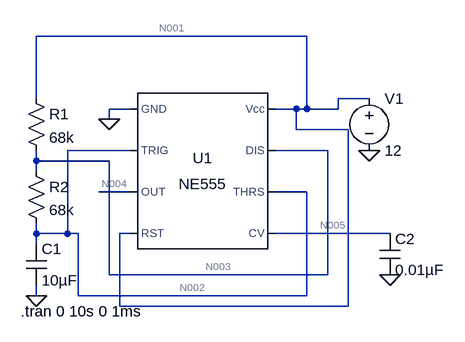
[diagram p0: schematic LEDdriverckt.asc]
LEDdriverckt.asc, the LTspice schematic file:
Version 4
SHEET 1 880 680
WIRE 272 -64 -144 -64
WIRE -144 32 -144 -64
WIRE 368 32 320 32
WIRE 0 48 -32 48
WIRE 256 48 224 48
WIRE 272 48 272 -64
WIRE 272 48 256 48
WIRE 320 48 320 32
WIRE 320 48 272 48
WIRE -32 64 -32 48
WIRE 256 80 256 48
WIRE 336 80 256 80
WIRE 0 112 -96 112
WIRE 304 112 224 112
WIRE -144 128 -144 112
WIRE -32 128 -144 128
WIRE -144 144 -144 128
WIRE 0 176 -48 176
WIRE 272 176 224 176
WIRE -144 240 -144 224
WIRE -96 240 -96 112
WIRE -96 240 -144 240
WIRE -80 240 -96 240
WIRE 0 240 -16 240
WIRE 400 240 224 240
WIRE -144 256 -144 240
WIRE -32 304 -32 128
WIRE 304 304 304 112
WIRE 304 304 -32 304
WIRE -144 336 -144 320
WIRE -80 336 -80 240
WIRE 272 336 272 176
WIRE 272 336 -80 336
WIRE -16 352 -16 240
WIRE 336 352 336 80
WIRE 336 352 -16 352
FLAG -144 336 0
FLAG -32 64 0
FLAG 368 112 0
FLAG 400 304 0
SYMBOL Misc\\NE555 112 144 R0
SYMATTR InstName U1
SYMBOL res -160 16 R0
SYMATTR InstName R1
SYMATTR Value 68k
SYMBOL res -160 128 R0
SYMATTR InstName R2
SYMATTR Value 68k
SYMBOL cap -160 256 R0
SYMATTR InstName C1
SYMATTR Value 10µF
SYMBOL cap 384 240 R0
SYMATTR InstName C2
SYMATTR Value 0.01µF
SYMBOL voltage 368 16 R0
WINDOW 123 0 0 Left 0
WINDOW 39 0 0 Left 0
SYMATTR InstName V1
SYMATTR Value 12
TEXT -168 360 Left 2 !.tran 0 10s 0 1ms

The netlist it stands for:
* LEDdriverckt.asc
XU1 0 N002 N004 N001 N005 N002 N003 N001 NE555  ; pins GND TRIG OUT RST CV THRS DIS Vcc
R1 N001 N003 68k
R2 N003 N002 68k
C1 N002 0 10µF
C2 N005 0 0.01µF
V1 N001 0 12
.tran 0 10s 0 1ms
.lib NE555.sub
.backanno
.end

* Results of the author's LTspice run, read from the files saved beside the schematic
* Operating Point, zero values left out:
*   V(n002) = 12 V
*   V(n005) = 8 V
*   V(n001) = 12 V
*   V(n003) = 12 V
*   V(n004) = 12 V
*   I(R2) = 23.99 nA
*   I(R1) = 40 nA
*   I(V1) = -3.881 mA
*   Ix(u1:1) = -3.881 mA
*   Ix(u1:2) = 12 nA
*   Ix(u1:4) = 69.33 µA
*   Ix(u1:6) = 12 nA
*   Ix(u1:7) = 16.01 nA
*   Ix(u1:8) = 3.812 mA
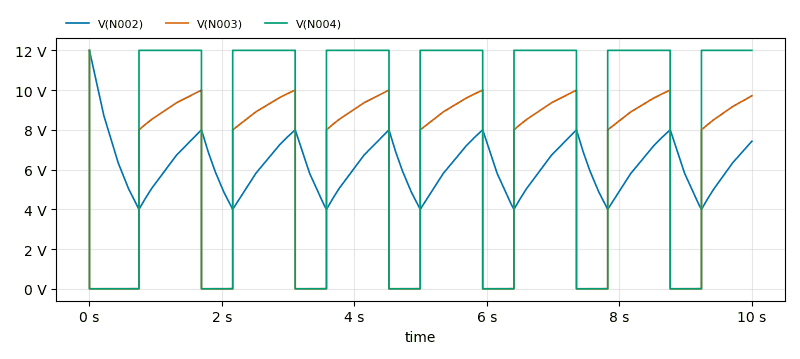
[diagram p1: Transient Analysis of LEDdriverckt.asc, plotted from the saved traces]
* Transient Analysis, 1 run:
*   V(N002): min 3.999 V, max 12 V, average 6.147 V, rms 6.317 V, last 7.427 V
*   V(N003): min 1.411 mV, max 12 V, average 5.833 V, rms 7.295 V, last 9.713 V
*   V(N004): min 72 µV, max 12 V, average 7.708 V, rms 9.617 V, last 12 V